# EAGLE schematic board-auto-wover (EAGLE 9.5.2)
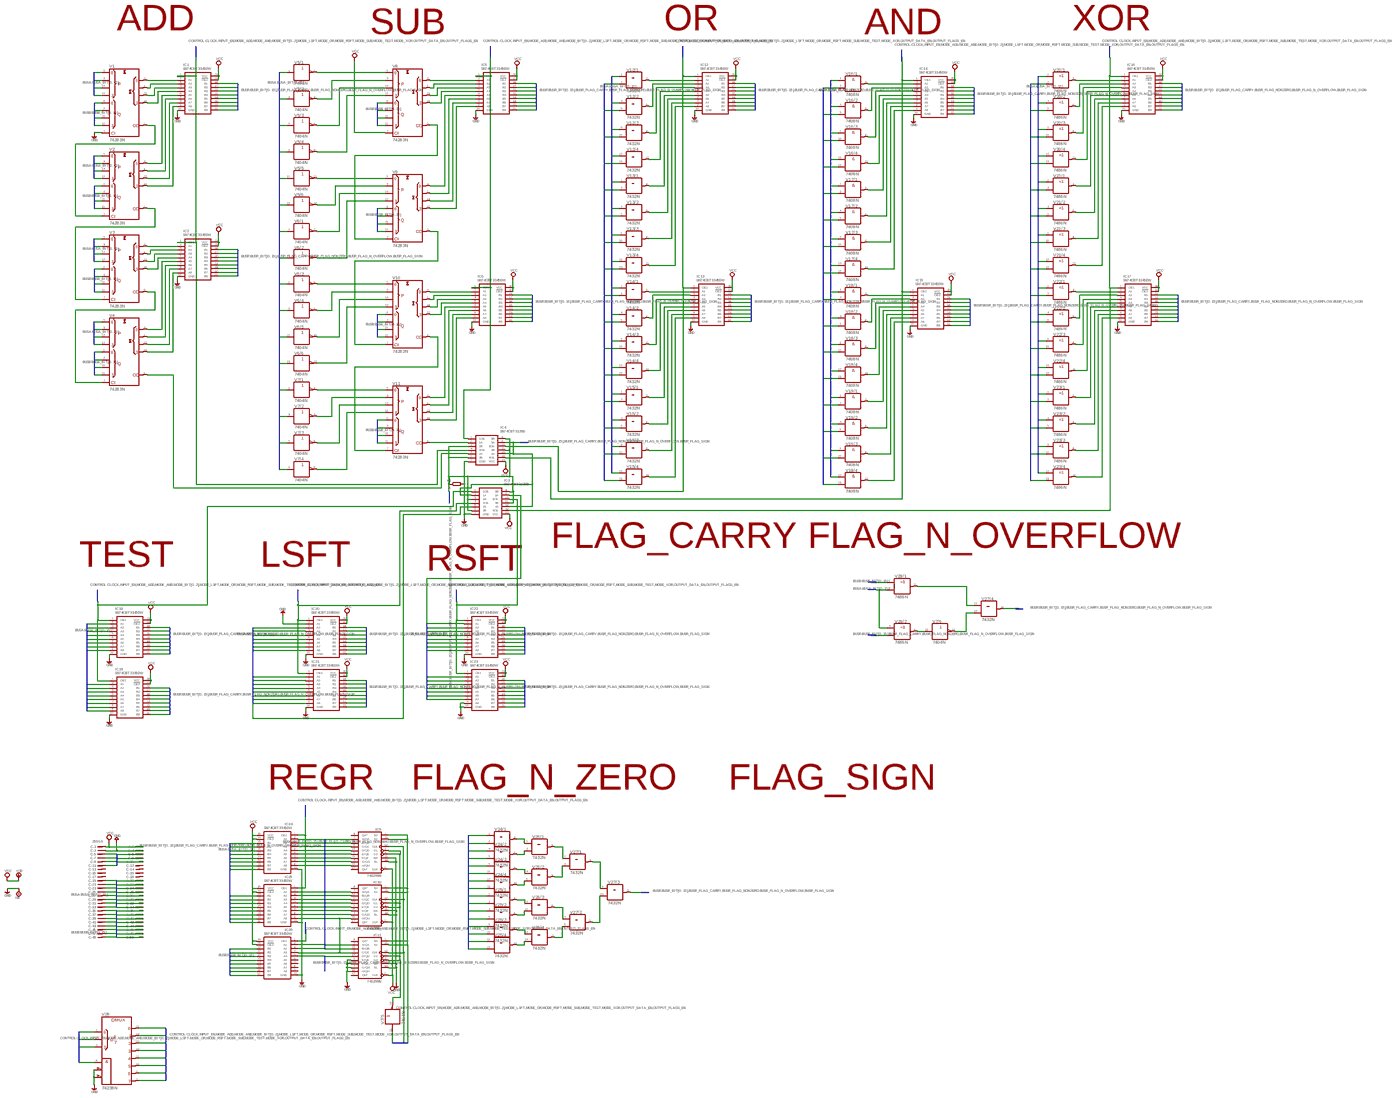
[diagram p0: schematic, sheet 1, overview]
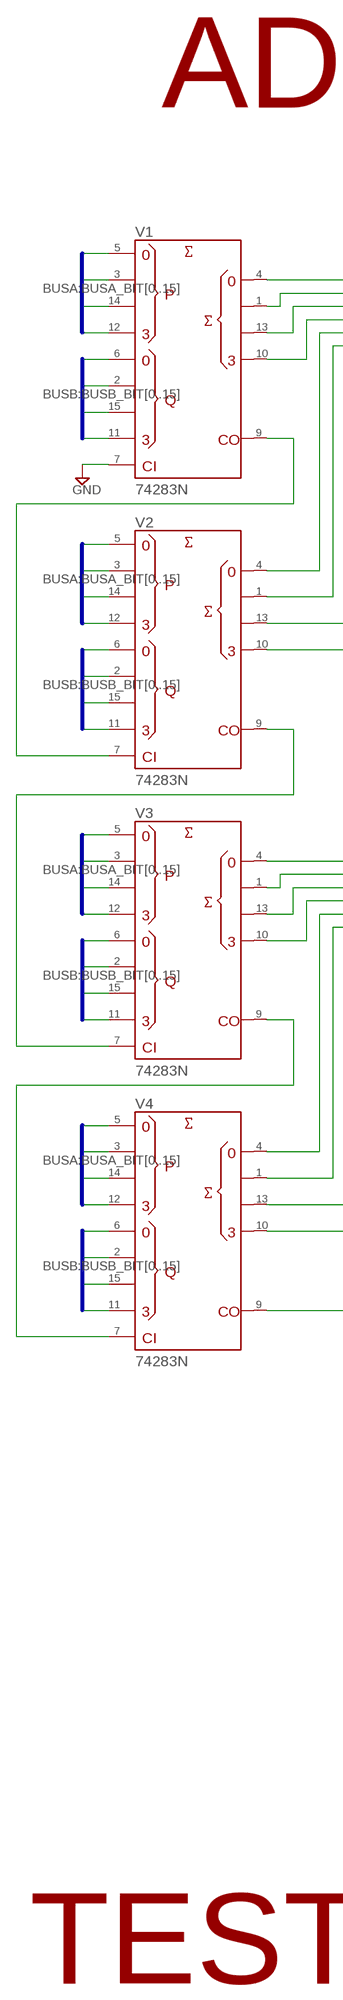
[diagram p1: schematic, sheet 1, part 1 of 6]
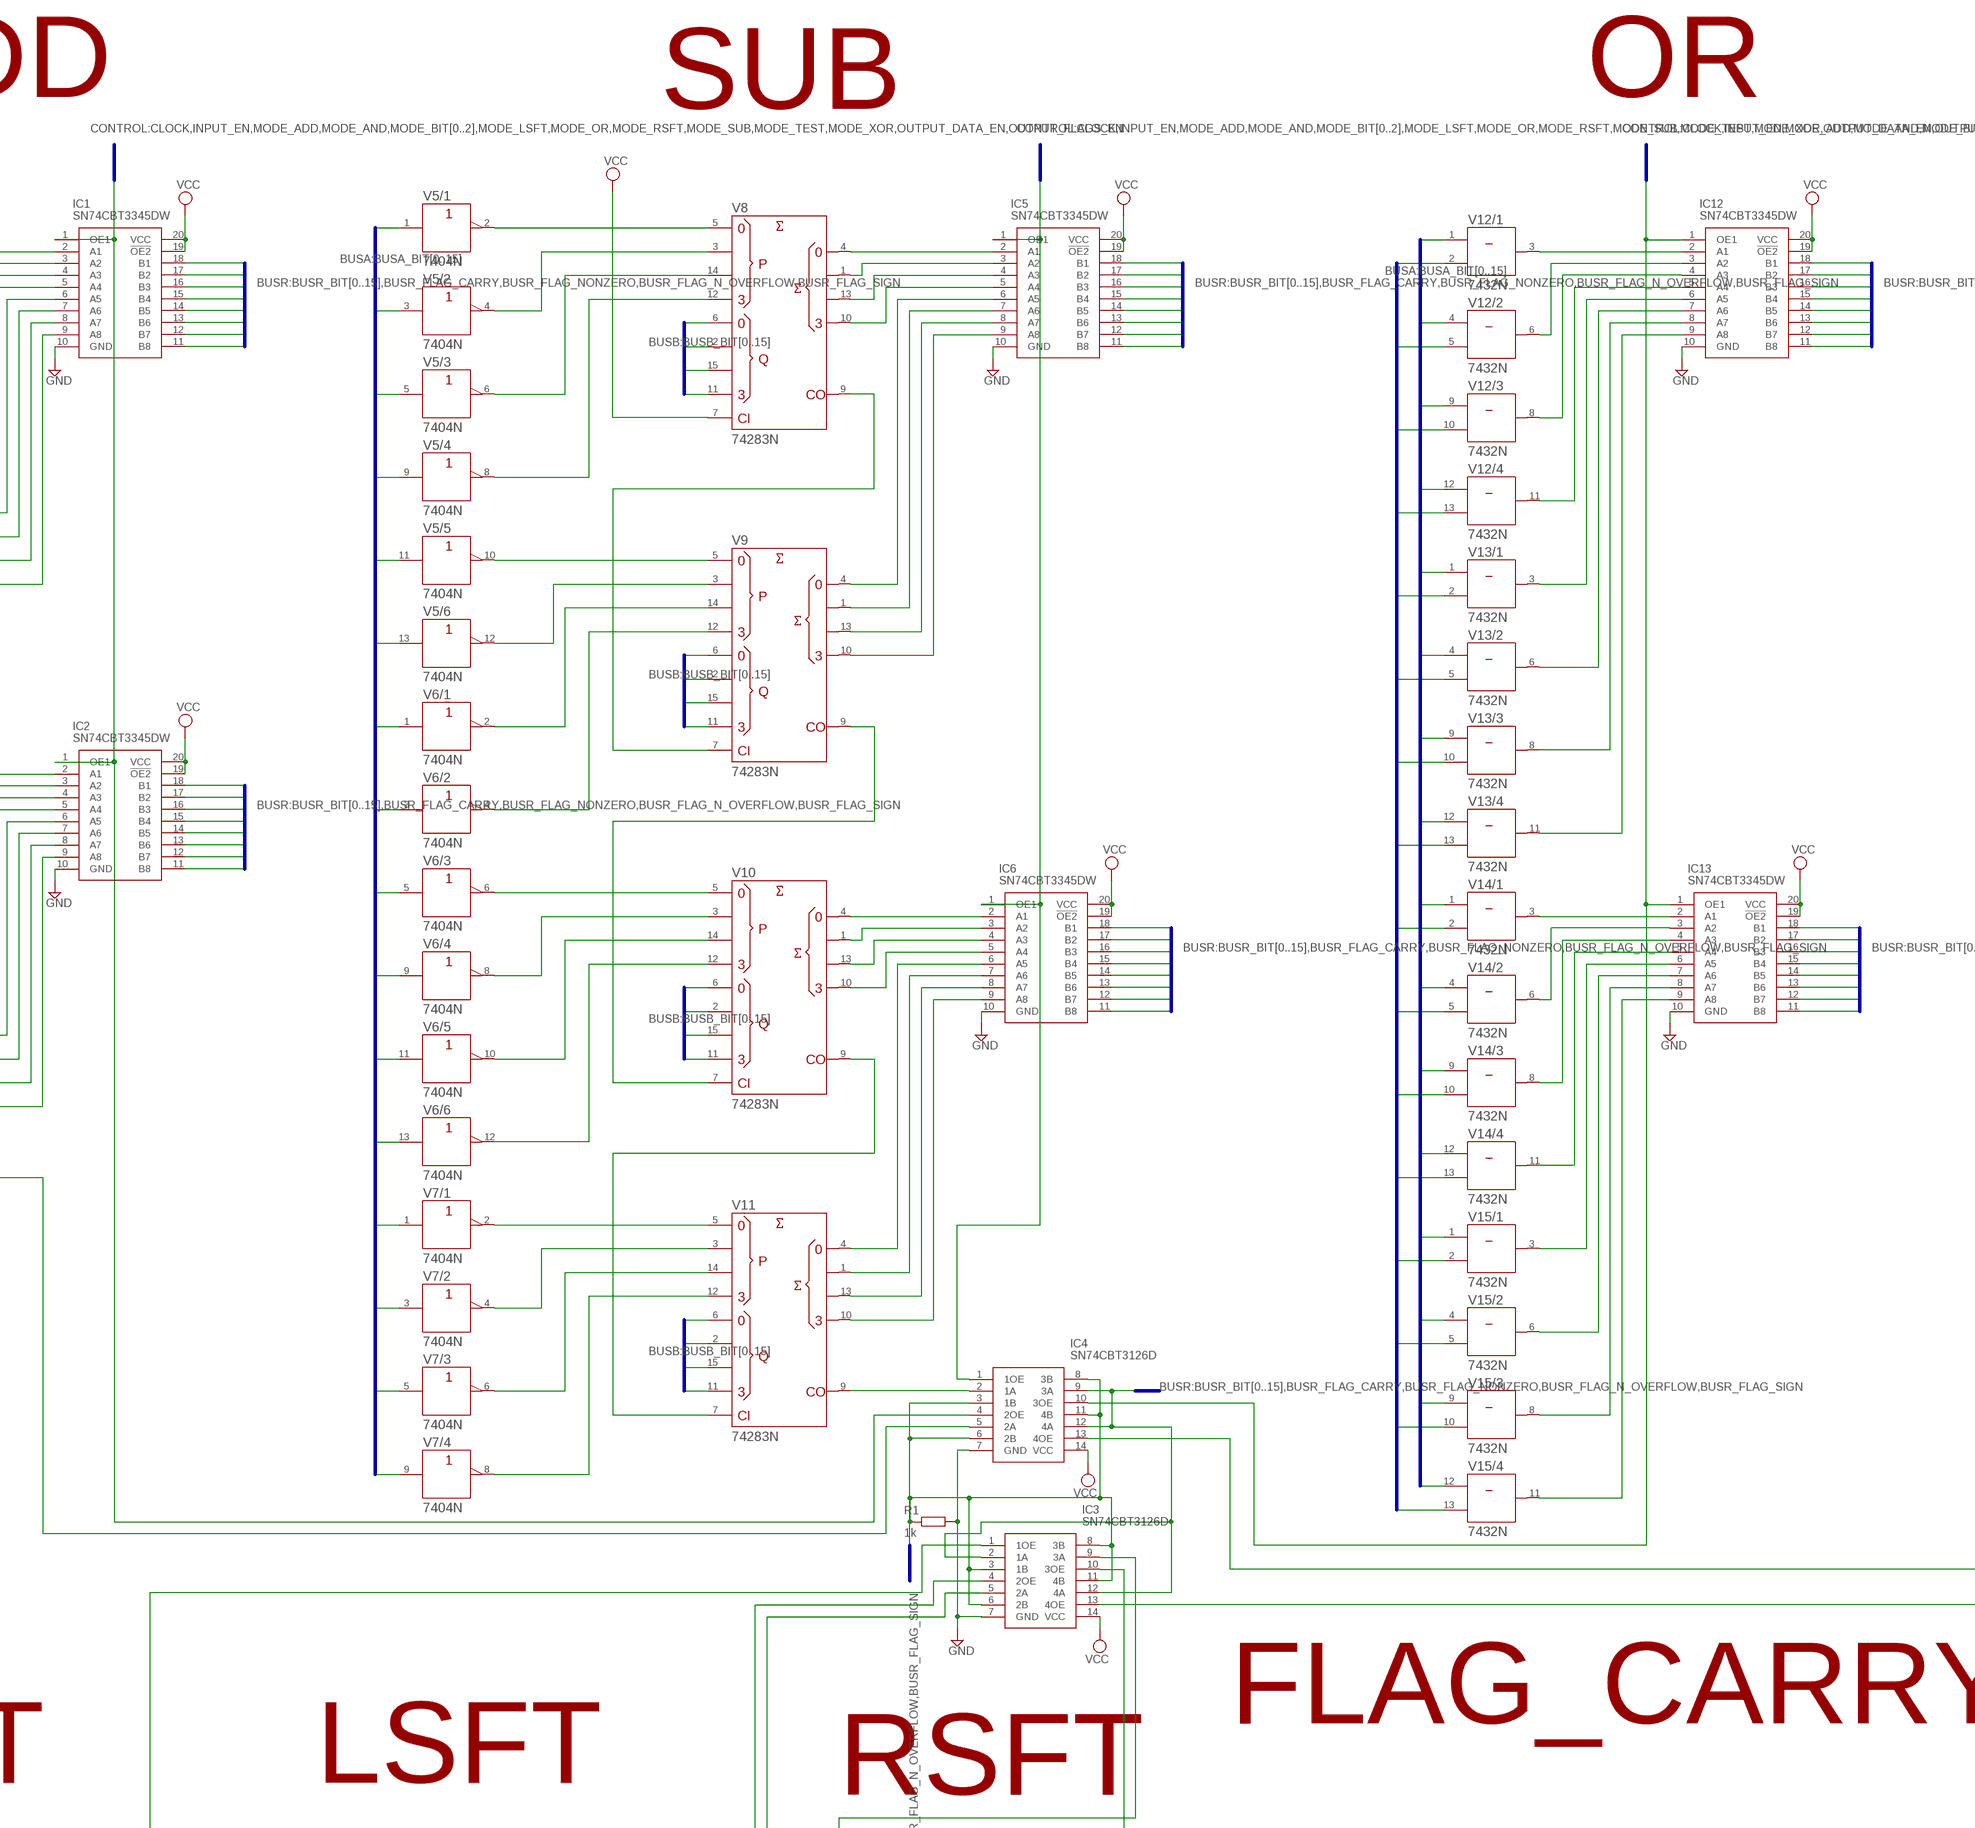
[diagram p2: schematic, sheet 1, part 2 of 6]
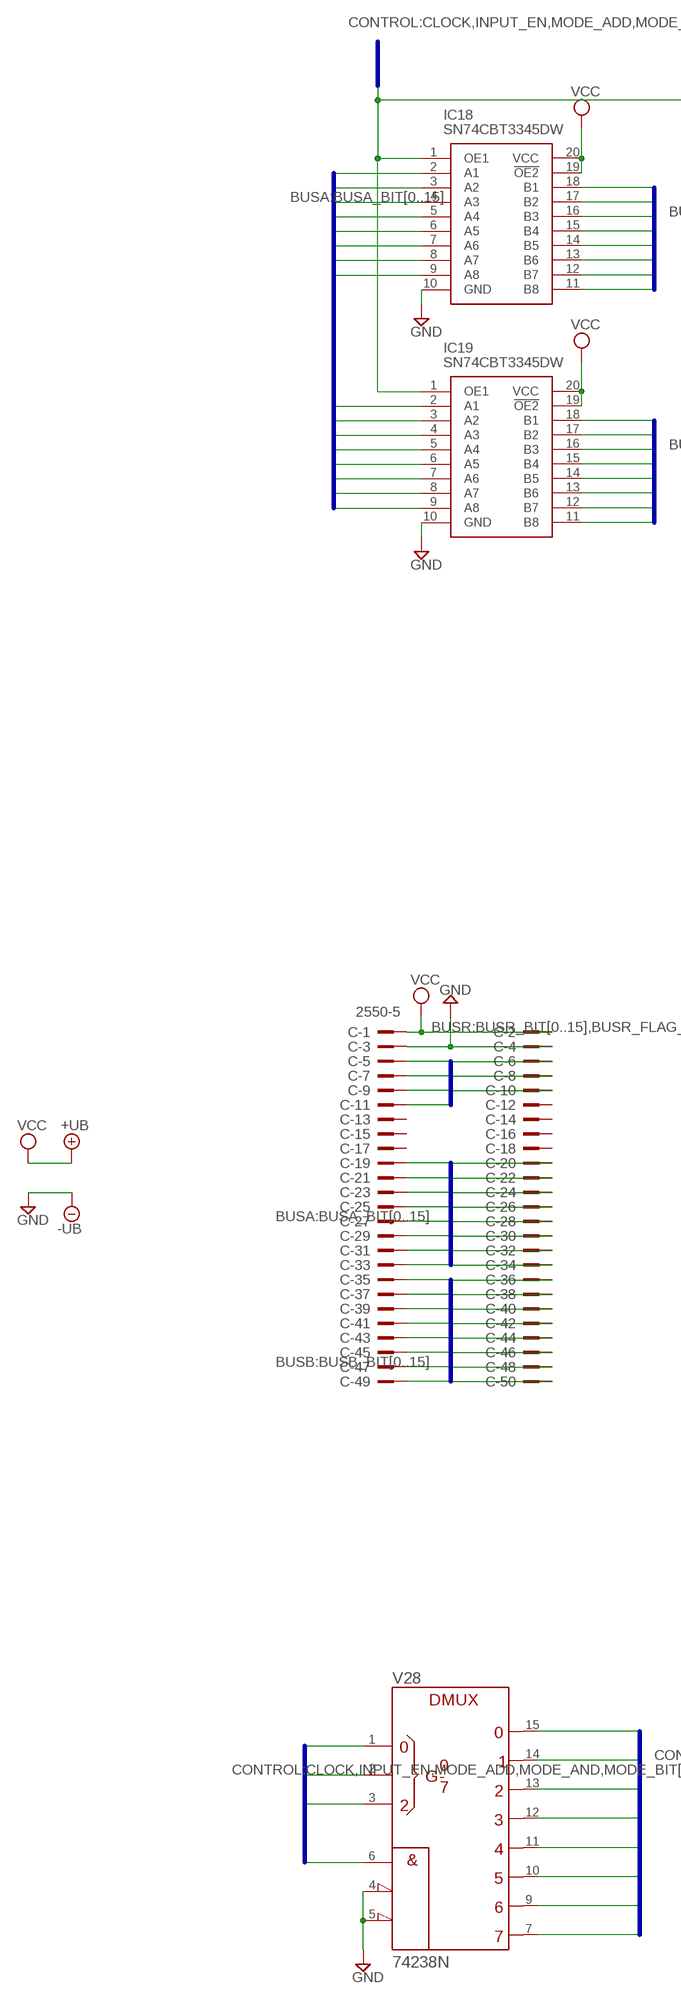
[diagram p3: schematic, sheet 1, part 3 of 6]
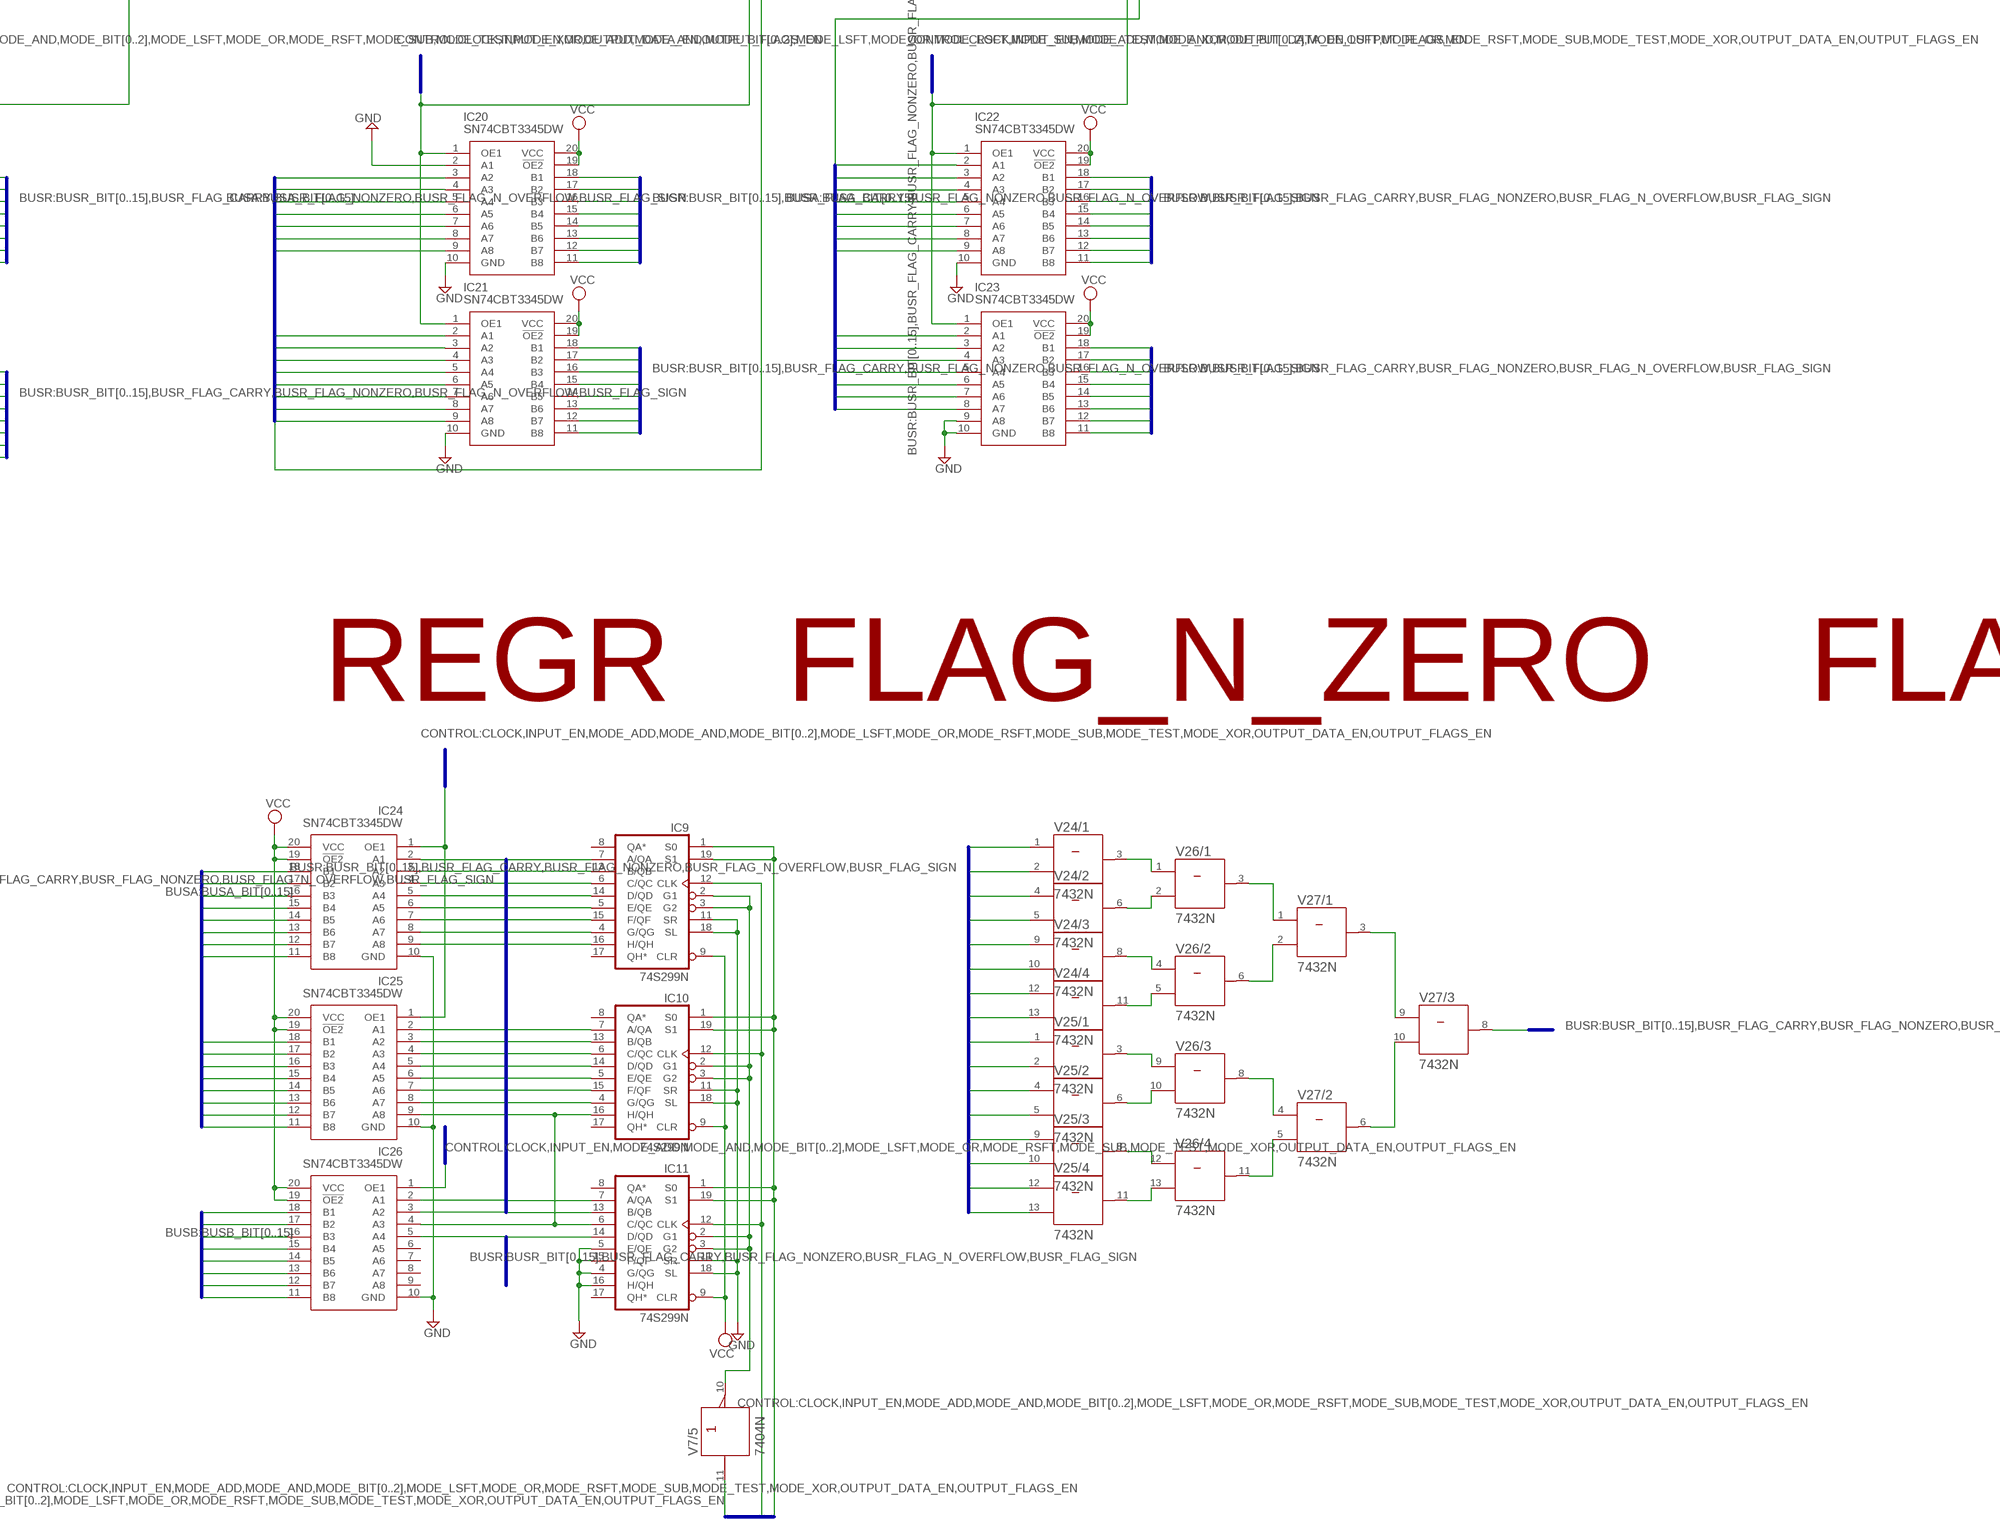
[diagram p4: schematic, sheet 1, part 4 of 6]
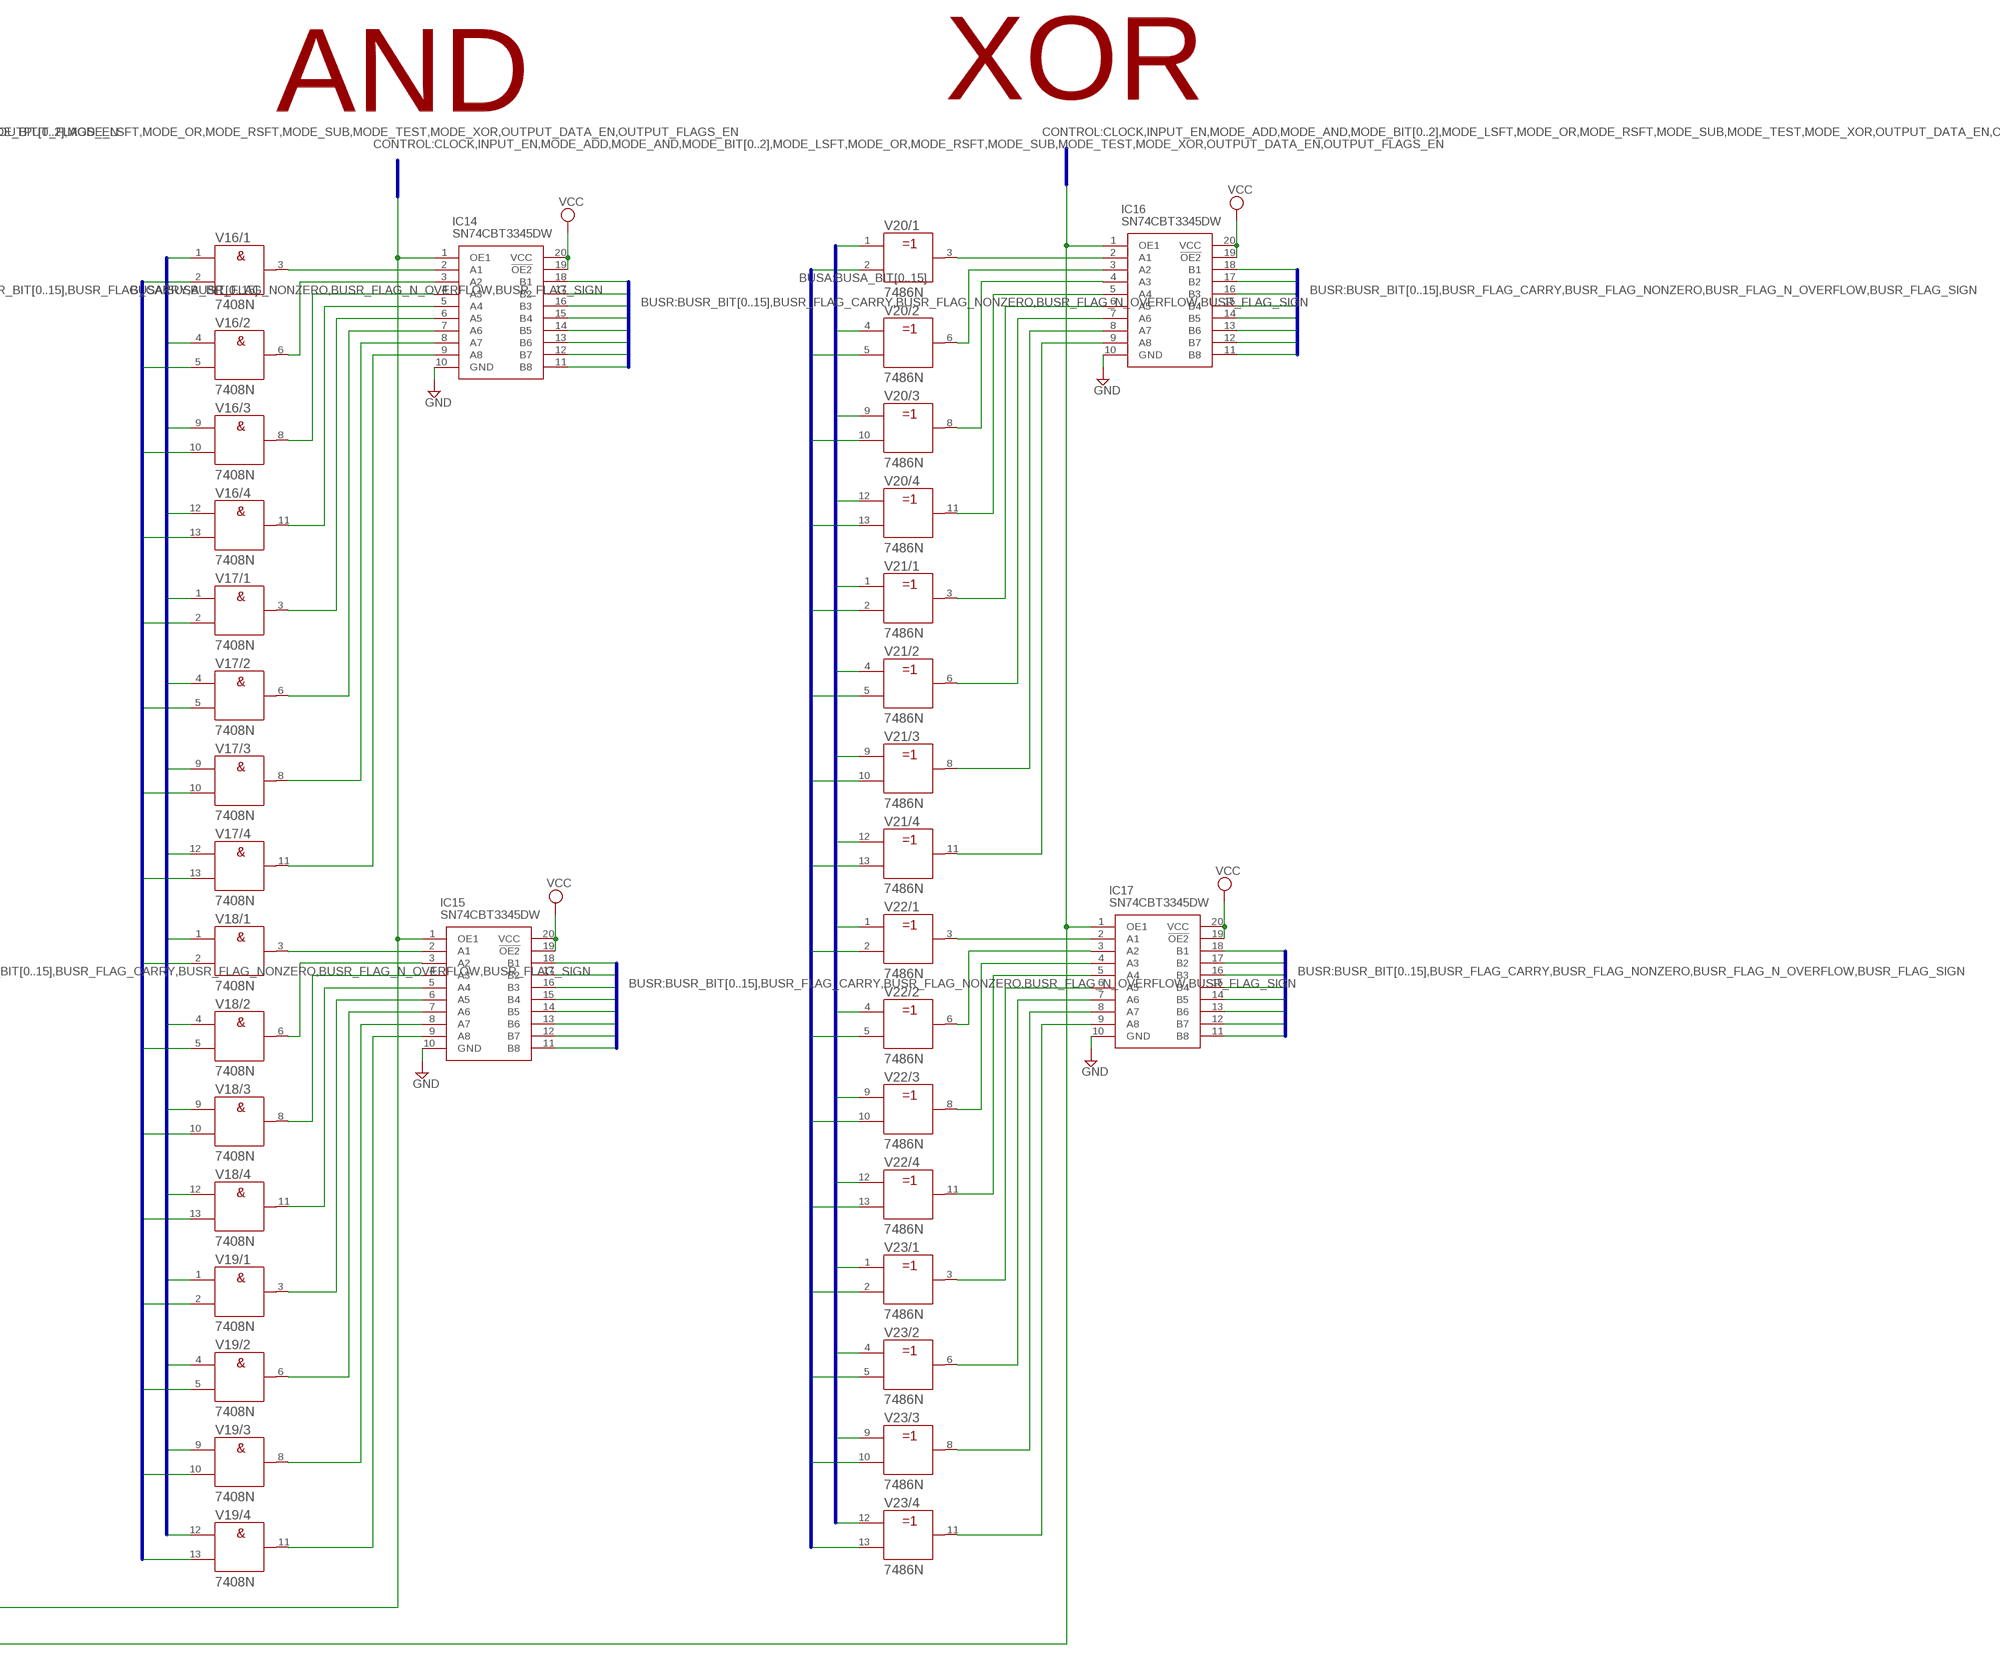
[diagram p5: schematic, sheet 1, part 5 of 6]
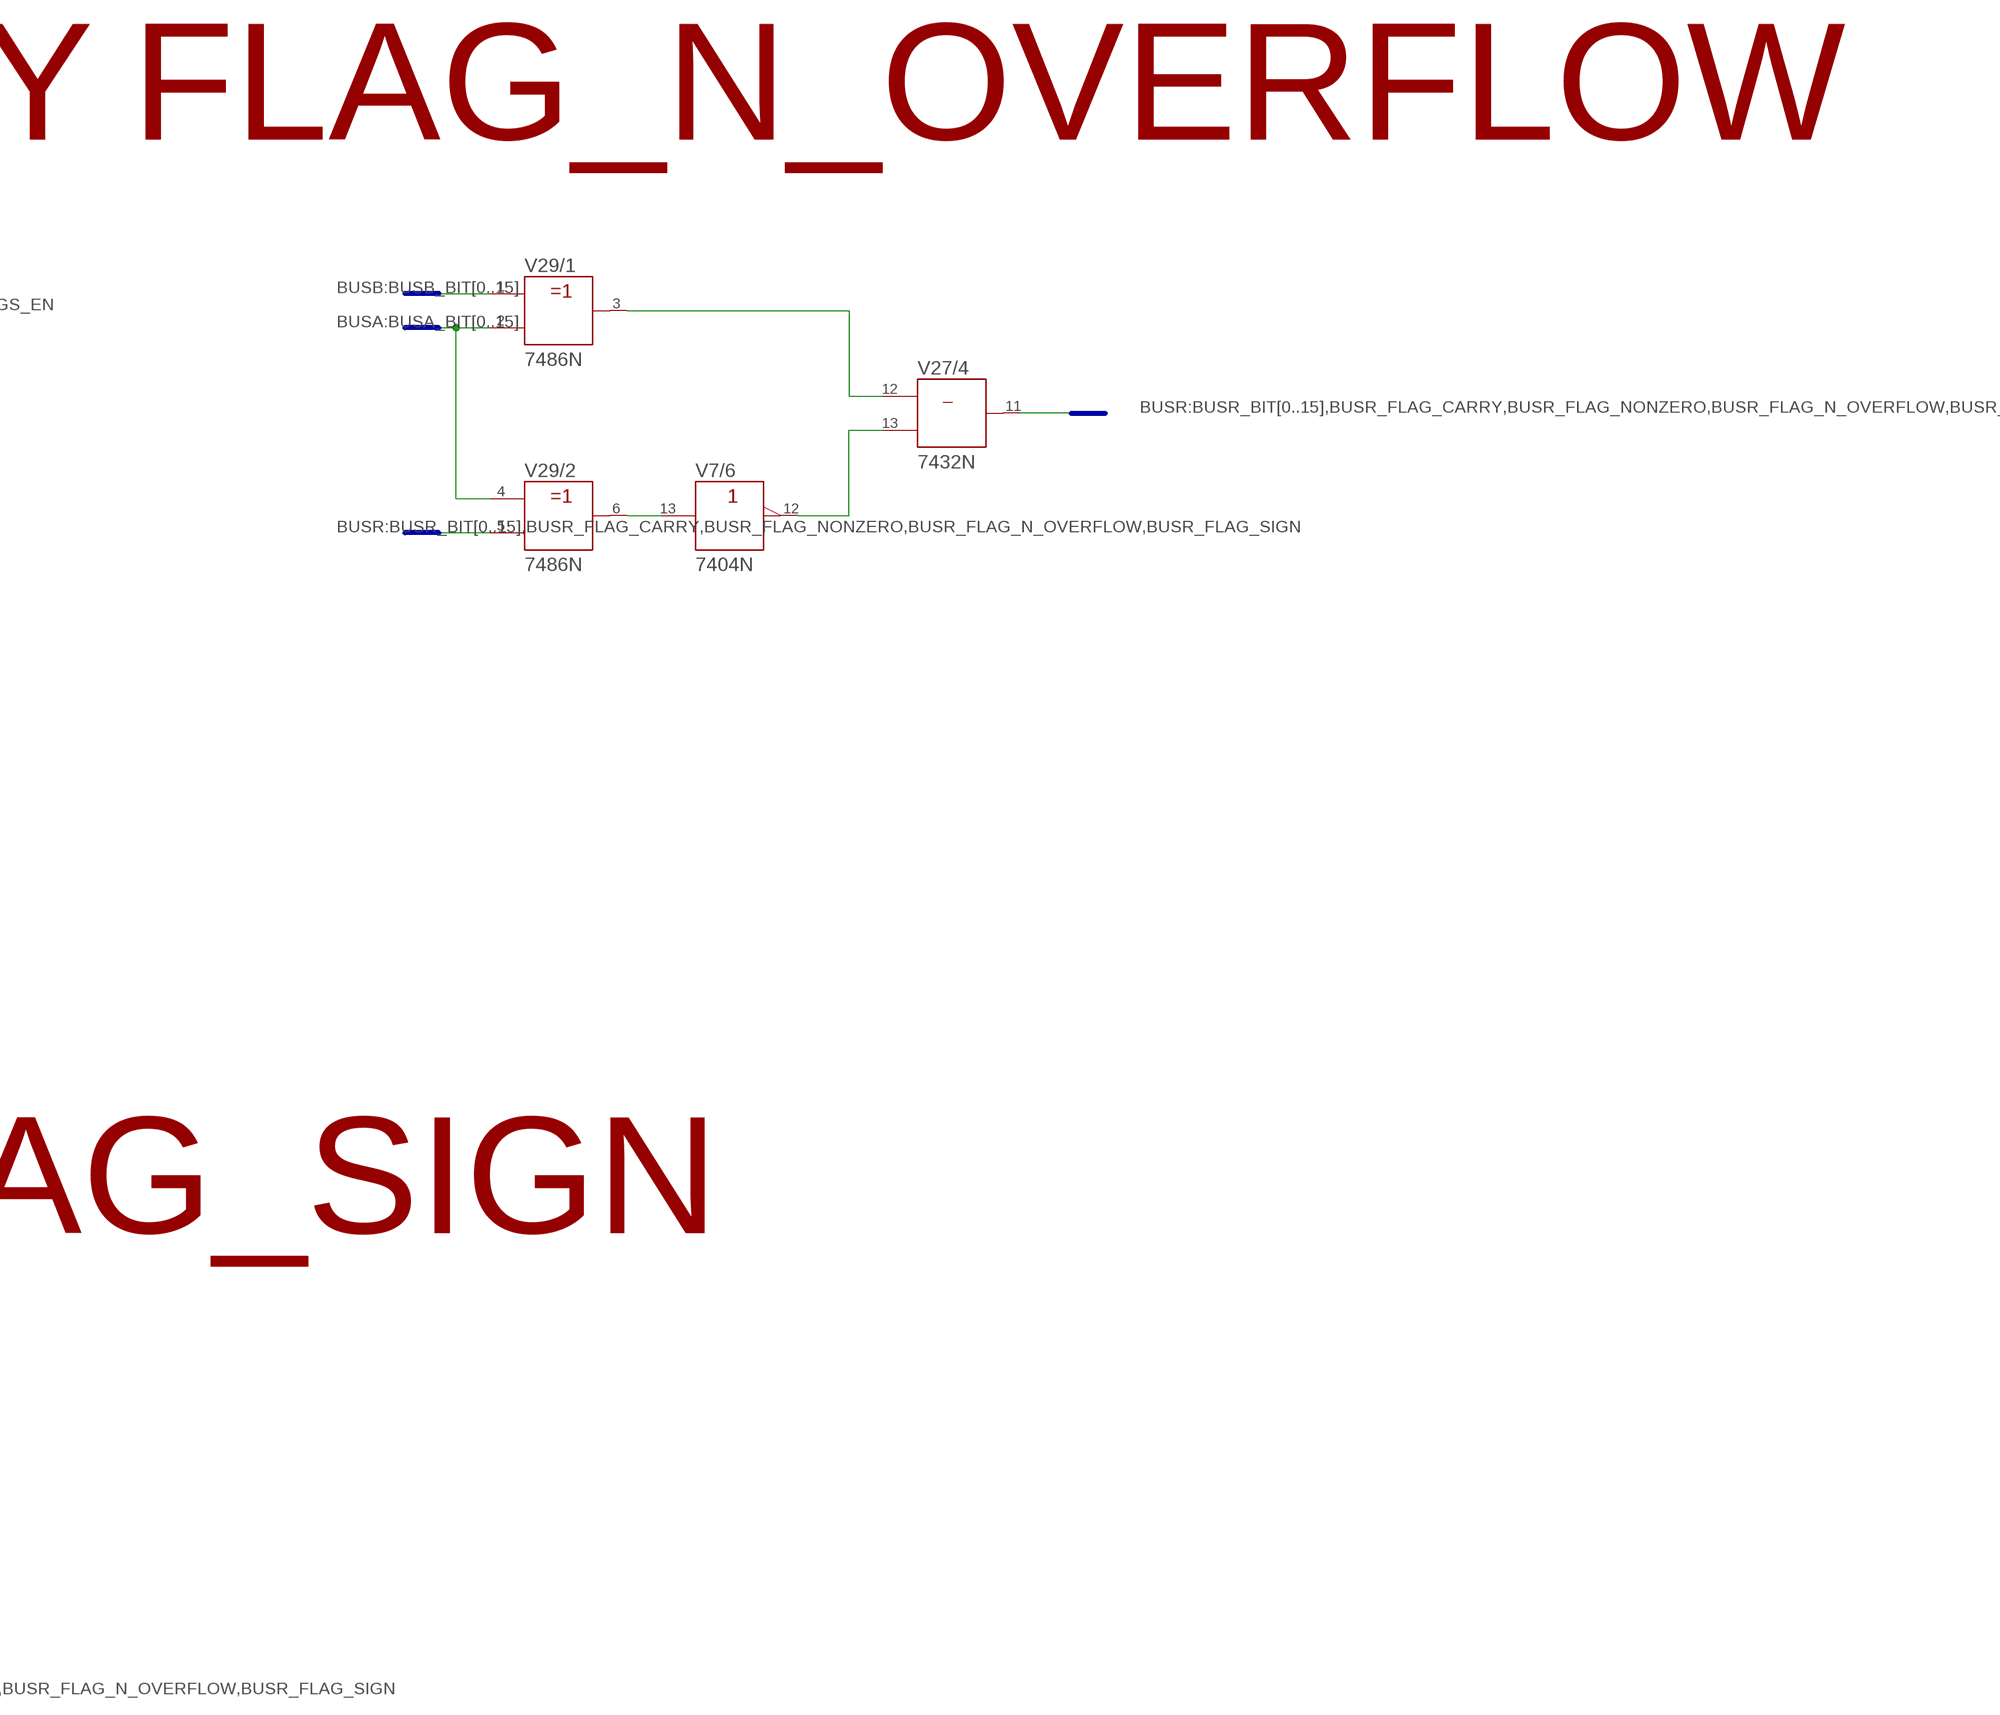
[diagram p6: schematic, sheet 1, part 6 of 6]

## Parts
C  2550-5  [PAK100/2500-5-50]
IC1  SN74CBT3345DW  [SOIC127P1030X265-20N]
IC2  SN74CBT3345DW  [SOIC127P1030X265-20N]
IC3  SN74CBT3126D  [SOIC127P600X175-14N]
IC4  SN74CBT3126D  [SOIC127P600X175-14N]
IC5  SN74CBT3345DW  [SOIC127P1030X265-20N]
IC6  SN74CBT3345DW  [SOIC127P1030X265-20N]
IC9  74S299N  [DIL20]
IC10  74S299N  [DIL20]
IC11  74S299N  [DIL20]
IC12  SN74CBT3345DW  [SOIC127P1030X265-20N]
IC13  SN74CBT3345DW  [SOIC127P1030X265-20N]
IC14  SN74CBT3345DW  [SOIC127P1030X265-20N]
IC15  SN74CBT3345DW  [SOIC127P1030X265-20N]
IC16  SN74CBT3345DW  [SOIC127P1030X265-20N]
IC17  SN74CBT3345DW  [SOIC127P1030X265-20N]
IC18  SN74CBT3345DW  [SOIC127P1030X265-20N]
IC19  SN74CBT3345DW  [SOIC127P1030X265-20N]
IC20  SN74CBT3345DW  [SOIC127P1030X265-20N]
IC21  SN74CBT3345DW  [SOIC127P1030X265-20N]
IC22  SN74CBT3345DW  [SOIC127P1030X265-20N]
IC23  SN74CBT3345DW  [SOIC127P1030X265-20N]
IC24  SN74CBT3345DW  [SOIC127P1030X265-20N]
IC25  SN74CBT3345DW  [SOIC127P1030X265-20N]
IC26  SN74CBT3345DW  [SOIC127P1030X265-20N]
R1  1k  R-EU_0207/10  [0207/10]
V1  74283N  [DIL16]
V2  74283N  [DIL16]
V3  74283N  [DIL16]
V4  74283N  [DIL16]
V5  7404N  [DIL14]
V6  7404N  [DIL14]
V7  7404N  [DIL14]
V8  74283N  [DIL16]
V9  74283N  [DIL16]
V10  74283N  [DIL16]
V11  74283N  [DIL16]
V12  7432N  [DIL14]
V13  7432N  [DIL14]
V14  7432N  [DIL14]
V15  7432N  [DIL14]
V16  7408N  [DIL14]
V17  7408N  [DIL14]
V18  7408N  [DIL14]
V19  7408N  [DIL14]
V20  7486N  [DIL14]
V21  7486N  [DIL14]
V22  7486N  [DIL14]
V23  7486N  [DIL14]
V24  7432N  [DIL14]
V25  7432N  [DIL14]
V26  7432N  [DIL14]
V27  7432N  [DIL14]
V28  74238N  [DIL16]
V29  7486N  [DIL14]

## Nets
BUSA_BIT0: C.19 IC3.9(3A) IC18.2(A1) IC20.3(A2) IC24.18(B1) V1.5(A1) V5.1(/1:A) V12.1(/1:A) V16.1(/1:A) V20.1(/1:A)
BUSA_BIT1: C.20 IC18.3(A2) IC20.4(A3) IC22.2(A1) IC24.17(B2) V1.3(A2) V5.3(/2:A) V12.4(/2:A) V16.4(/2:A) V20.4(/2:A)
BUSA_BIT2: C.21 IC18.4(A3) IC20.5(A4) IC22.3(A2) IC24.16(B3) V1.14(A3) V5.5(/3:A) V12.9(/3:A) V16.9(/3:A) V20.9(/3:A)
BUSA_BIT3: C.22 IC18.5(A4) IC20.6(A5) IC22.4(A3) IC24.15(B4) V1.12(A4) V5.9(/4:A) V12.12(/4:A) V16.12(/4:A) V20.12(/4:A)
BUSA_BIT4: C.23 IC18.6(A5) IC20.7(A6) IC22.5(A4) IC24.14(B5) V2.5(A1) V5.11(/5:A) V13.1(/1:A) V17.1(/1:A) V21.1(/1:A)
BUSA_BIT5: C.24 IC18.7(A6) IC20.8(A7) IC22.6(A5) IC24.13(B6) V2.3(A2) V5.13(/6:A) V13.4(/2:A) V17.4(/2:A) V21.4(/2:A)
BUSA_BIT6: C.25 IC18.8(A7) IC20.9(A8) IC22.7(A6) IC24.12(B7) V2.14(A3) V6.1(/1:A) V13.9(/3:A) V17.9(/3:A) V21.9(/3:A)
BUSA_BIT7: C.26 IC18.9(A8) IC21.2(A1) IC22.8(A7) IC24.11(B8) V2.12(A4) V6.3(/2:A) V13.12(/4:A) V17.12(/4:A) V21.12(/4:A)
BUSA_BIT8: C.27 IC19.2(A1) IC21.3(A2) IC22.9(A8) IC25.18(B1) V3.5(A1) V6.5(/3:A) V14.1(/1:A) V18.1(/1:A) V22.1(/1:A)
BUSA_BIT9: C.28 IC19.3(A2) IC21.4(A3) IC23.2(A1) IC25.17(B2) V3.3(A2) V6.9(/4:A) V14.4(/2:A) V18.4(/2:A) V22.4(/2:A)
BUSA_BIT10: C.29 IC19.4(A3) IC21.5(A4) IC23.3(A2) IC25.16(B3) V3.14(A3) V6.11(/5:A) V14.9(/3:A) V18.9(/3:A) V22.9(/3:A)
BUSA_BIT11: C.30 IC19.5(A4) IC21.6(A5) IC23.4(A3) IC25.15(B4) V3.12(A4) V6.13(/6:A) V14.12(/4:A) V18.12(/4:A) V22.12(/4:A)
BUSA_BIT12: C.31 IC19.6(A5) IC21.7(A6) IC23.5(A4) IC25.14(B5) V4.5(A1) V7.1(/1:A) V15.1(/1:A) V19.1(/1:A) V23.1(/1:A)
BUSA_BIT13: C.32 IC19.7(A6) IC21.8(A7) IC23.6(A5) IC25.13(B6) V4.3(A2) V7.3(/2:A) V15.4(/2:A) V19.4(/2:A) V23.4(/2:A)
BUSA_BIT14: C.33 IC19.8(A7) IC21.9(A8) IC23.7(A6) IC25.12(B7) V4.14(A3) V7.5(/3:A) V15.9(/3:A) V19.9(/3:A) V23.9(/3:A)
BUSA_BIT15: C.34 IC3.5(2A) IC19.9(A8) IC23.8(A7) IC25.11(B8) V4.12(A4) V7.9(/4:A) V15.12(/4:A) V19.12(/4:A) V23.12(/4:A) V29.2(/1:B) V29.4(/2:A)
BUSB_BIT0: C.35 IC26.18(B1) V1.6(B1) V8.6(B1) V12.2(/1:B) V16.2(/1:B) V20.2(/1:B)
BUSB_BIT1: C.36 IC26.17(B2) V1.2(B2) V8.2(B2) V12.5(/2:B) V16.5(/2:B) V20.5(/2:B)
BUSB_BIT2: C.37 IC26.16(B3) V1.15(B3) V8.15(B3) V12.10(/3:B) V16.10(/3:B) V20.10(/3:B)
BUSB_BIT3: C.38 IC26.15(B4) V1.11(B4) V8.11(B4) V12.13(/4:B) V16.13(/4:B) V20.13(/4:B)
BUSB_BIT4: C.39 IC26.14(B5) V2.6(B1) V9.6(B1) V13.2(/1:B) V17.2(/1:B) V21.2(/1:B)
BUSB_BIT5: C.40 IC26.13(B6) V2.2(B2) V9.2(B2) V13.5(/2:B) V17.5(/2:B) V21.5(/2:B)
BUSB_BIT6: C.41 IC26.12(B7) V2.15(B3) V9.15(B3) V13.10(/3:B) V17.10(/3:B) V21.10(/3:B)
BUSB_BIT7: C.42 IC26.11(B8) V2.11(B4) V9.11(B4) V13.13(/4:B) V17.13(/4:B) V21.13(/4:B)
BUSB_BIT8: C.43 V3.6(B1) V10.6(B1) V14.2(/1:B) V18.2(/1:B) V22.2(/1:B)
BUSB_BIT9: C.44 V3.2(B2) V10.2(B2) V14.5(/2:B) V18.5(/2:B) V22.5(/2:B)
BUSB_BIT10: C.45 V3.15(B3) V10.15(B3) V14.10(/3:B) V18.10(/3:B) V22.10(/3:B)
BUSB_BIT11: C.46 V3.11(B4) V10.11(B4) V14.13(/4:B) V18.13(/4:B) V22.13(/4:B)
BUSB_BIT12: C.47 V4.6(B1) V11.6(B1) V15.2(/1:B) V19.2(/1:B) V23.2(/1:B)
BUSB_BIT13: C.48 V4.2(B2) V11.2(B2) V15.5(/2:B) V19.5(/2:B) V23.5(/2:B)
BUSB_BIT14: C.49 V4.15(B3) V11.15(B3) V15.10(/3:B) V19.10(/3:B) V23.10(/3:B)
BUSB_BIT15: C.50 V4.11(B4) V11.11(B4) V15.13(/4:B) V19.13(/4:B) V23.13(/4:B) V29.1(/1:A)
BUSR_BIT0: IC1.18(B1) IC3.2(1A) IC3.12(4A) IC4.9(3A) IC4.12(4A) IC5.18(B1) IC9.7(A/QA) IC12.18(B1) IC14.18(B1) IC16.18(B1) IC18.18(B1) IC20.18(B1) IC22.18(B1) IC24.2(A1) V24.1(/1:A)
BUSR_BIT1: IC1.17(B2) IC5.17(B2) IC9.13(B/QB) IC12.17(B2) IC14.17(B2) IC16.17(B2) IC18.17(B2) IC20.17(B2) IC22.17(B2) IC24.3(A2) V24.2(/1:B)
BUSR_BIT2: IC1.16(B3) IC5.16(B3) IC9.6(C/QC) IC12.16(B3) IC14.16(B3) IC16.16(B3) IC18.16(B3) IC20.16(B3) IC22.16(B3) IC24.4(A3) V24.4(/2:A)
BUSR_BIT3: IC1.15(B4) IC5.15(B4) IC9.14(D/QD) IC12.15(B4) IC14.15(B4) IC16.15(B4) IC18.15(B4) IC20.15(B4) IC22.15(B4) IC24.5(A4) V24.5(/2:B)
BUSR_BIT4: IC1.14(B5) IC5.14(B5) IC9.5(E/QE) IC12.14(B5) IC14.14(B5) IC16.14(B5) IC18.14(B5) IC20.14(B5) IC22.14(B5) IC24.6(A5) V24.9(/3:A)
BUSR_BIT5: IC1.13(B6) IC5.13(B6) IC9.15(F/QF) IC12.13(B6) IC14.13(B6) IC16.13(B6) IC18.13(B6) IC20.13(B6) IC22.13(B6) IC24.7(A6) V24.10(/3:B)
BUSR_BIT6: IC1.12(B7) IC5.12(B7) IC9.4(G/QG) IC12.12(B7) IC14.12(B7) IC16.12(B7) IC18.12(B7) IC20.12(B7) IC22.12(B7) IC24.8(A7) V24.12(/4:A)
BUSR_BIT7: IC1.11(B8) IC5.11(B8) IC9.16(H/QH) IC12.11(B8) IC14.11(B8) IC16.11(B8) IC18.11(B8) IC20.11(B8) IC22.11(B8) IC24.9(A8) V24.13(/4:B)
BUSR_BIT8: IC2.18(B1) IC6.18(B1) IC10.7(A/QA) IC13.18(B1) IC15.18(B1) IC17.18(B1) IC19.18(B1) IC21.18(B1) IC23.18(B1) IC25.2(A1) V25.1(/1:A)
BUSR_BIT9: IC2.17(B2) IC6.17(B2) IC10.13(B/QB) IC13.17(B2) IC15.17(B2) IC17.17(B2) IC19.17(B2) IC21.17(B2) IC23.17(B2) IC25.3(A2) V25.2(/1:B)
BUSR_BIT10: IC2.16(B3) IC6.16(B3) IC10.6(C/QC) IC13.16(B3) IC15.16(B3) IC17.16(B3) IC19.16(B3) IC21.16(B3) IC23.16(B3) IC25.4(A3) V25.4(/2:A)
BUSR_BIT11: IC2.15(B4) IC6.15(B4) IC10.14(D/QD) IC13.15(B4) IC15.15(B4) IC17.15(B4) IC19.15(B4) IC21.15(B4) IC23.15(B4) IC25.5(A4) V25.5(/2:B)
BUSR_BIT12: IC2.14(B5) IC6.14(B5) IC10.5(E/QE) IC13.14(B5) IC15.14(B5) IC17.14(B5) IC19.14(B5) IC21.14(B5) IC23.14(B5) IC25.6(A5) V25.9(/3:A)
BUSR_BIT13: IC2.13(B6) IC6.13(B6) IC10.15(F/QF) IC13.13(B6) IC15.13(B6) IC17.13(B6) IC19.13(B6) IC21.13(B6) IC23.13(B6) IC25.7(A6) V25.10(/3:B)
BUSR_BIT14: IC2.12(B7) IC6.12(B7) IC10.4(G/QG) IC13.12(B7) IC15.12(B7) IC17.12(B7) IC19.12(B7) IC21.12(B7) IC23.12(B7) IC25.8(A7) V25.12(/4:A)
BUSR_BIT15: IC2.11(B8) IC6.11(B8) IC10.16(H/QH) IC11.6(C/QC) IC13.11(B8) IC15.11(B8) IC17.11(B8) IC19.11(B8) IC21.11(B8) IC23.11(B8) IC25.9(A8) IC26.4(A3) V25.13(/4:B) V29.5(/2:B)
BUSR_FLAG_CARRY: IC3.3(1B) IC3.6(2B) IC3.8(3B) IC3.11(4B) IC4.3(1B) IC4.6(2B) IC4.8(3B) IC4.11(4B) IC11.7(A/QA) IC26.2(A1) R1.1
BUSR_FLAG_N_OVERFLOW: IC11.14(D/QD) IC26.5(A4) V27.11(/4:Y)
BUSR_FLAG_NONZERO: IC11.13(B/QB) IC26.3(A2) V27.8(/3:Y)
CLOCK: C.5 IC9.12(CLK) IC10.12(CLK) IC11.12(CLK)
GND: C.3 C.4 IC1.10(GND) IC2.10(GND) IC3.7(GND) IC4.7(GND) IC5.10(GND) IC6.10(GND) IC9.11(SR) IC9.18(SL) IC10.11(SR) IC10.18(SL) IC11.4(G/QG) IC11.5(E/QE) IC11.11(SR) IC11.15(F/QF) IC11.16(H/QH) IC11.18(SL) IC12.10(GND) IC13.10(GND) IC14.10(GND) IC15.10(GND) IC16.10(GND) IC17.10(GND) IC18.10(GND) IC19.10(GND) IC20.2(A1) IC20.10(GND) IC21.10(GND) IC22.10(GND) IC23.9(A8) IC23.10(GND) IC24.10(GND) IC25.10(GND) IC26.10(GND) R1.2 V1.7(C0) V28.4(!G2A) V28.5(!G2B) ; supply symbol labelled -UB
INPUT_EN: C.7 IC9.1(S0) IC9.19(S1) IC10.1(S0) IC10.19(S1) IC11.1(S0) IC11.19(S1) V28.6(G1)
MODE_ADD: IC1.1(OE1) IC2.1(OE1) IC4.4(2OE) V28.15(Y0)
MODE_AND: IC4.13(4OE) IC14.1(OE1) IC15.1(OE1) V28.13(Y2)
MODE_BIT0: C.6 V28.1(A)
MODE_BIT1: C.8 V28.2(B)
MODE_BIT2: C.10 V28.3(C)
MODE_LSFT: IC3.4(2OE) IC20.1(OE1) IC21.1(OE1) V28.10(Y5)
MODE_OR: IC4.10(3OE) IC12.1(OE1) IC13.1(OE1) V28.12(Y3)
MODE_RSFT: IC3.10(3OE) IC22.1(OE1) IC23.1(OE1) V28.9(Y6)
MODE_SUB: IC4.1(1OE) IC5.1(OE1) IC6.1(OE1) V28.14(Y1)
MODE_TEST: IC3.1(1OE) IC18.1(OE1) IC19.1(OE1) V28.7(Y7)
MODE_XOR: IC3.13(4OE) IC16.1(OE1) IC17.1(OE1) V28.11(Y4)
N$1: V1.9(C4) V2.7(C0)
N$2: V2.9(C4) V3.7(C0)
N$3: V3.9(C4) V4.7(C0)
N$4: V8.9(C4) V9.7(C0)
N$5: V9.9(C4) V10.7(C0)
N$6: V10.9(C4) V11.7(C0)
N$7: V5.2(/1:Y) V8.5(A1)
N$8: V5.4(/2:Y) V8.3(A2)
N$9: V5.6(/3:Y) V8.14(A3)
N$10: V5.8(/4:Y) V8.12(A4)
N$11: V5.10(/5:Y) V9.5(A1)
N$12: V5.12(/6:Y) V9.3(A2)
N$13: V6.2(/1:Y) V9.14(A3)
N$14: V6.4(/2:Y) V9.12(A4)
N$15: V6.6(/3:Y) V10.5(A1)
N$16: V6.8(/4:Y) V10.3(A2)
N$17: V6.10(/5:Y) V10.14(A3)
N$18: V6.12(/6:Y) V10.12(A4)
N$19: V7.2(/1:Y) V11.5(A1)
N$20: V7.4(/2:Y) V11.3(A2)
N$21: V7.6(/3:Y) V11.14(A3)
N$22: V7.8(/4:Y) V11.12(A4)
N$23: IC1.2(A1) V1.4(S1)
N$24: IC1.3(A2) V1.1(S2)
N$25: IC1.4(A3) V1.13(S3)
N$26: IC1.5(A4) V1.10(S4)
N$27: IC1.6(A5) V2.4(S1)
N$28: IC1.7(A6) V2.1(S2)
N$29: IC1.8(A7) V2.13(S3)
N$30: IC1.9(A8) V2.10(S4)
N$31: IC2.2(A1) V3.4(S1)
N$32: IC2.3(A2) V3.1(S2)
N$33: IC2.4(A3) V3.13(S3)
N$34: IC2.5(A4) V3.10(S4)
N$35: IC2.6(A5) V4.4(S1)
N$36: IC2.7(A6) V4.1(S2)
N$37: IC2.8(A7) V4.13(S3)
N$38: IC2.9(A8) V4.10(S4)
N$39: IC5.2(A1) V8.4(S1)
N$40: IC5.3(A2) V8.1(S2)
N$41: IC5.4(A3) V8.13(S3)
N$42: IC5.5(A4) V8.10(S4)
N$43: IC5.6(A5) V9.4(S1)
N$44: IC5.7(A6) V9.1(S2)
N$45: IC5.8(A7) V9.13(S3)
N$46: IC5.9(A8) V9.10(S4)
N$47: IC6.2(A1) V10.4(S1)
N$48: IC6.3(A2) V10.1(S2)
N$49: IC4.5(2A) V4.9(C4)
N$50: IC6.5(A4) V10.10(S4)
N$51: IC6.6(A5) V11.4(S1)
N$52: IC6.7(A6) V11.1(S2)
N$53: IC6.8(A7) V11.13(S3)
N$54: IC6.9(A8) V11.10(S4)
N$55: IC13.8(A7) V15.8(/3:Y)
N$56: IC6.4(A3) V10.13(S3)
N$57: IC4.2(1A) V11.9(C4)
N$58: IC14.2(A1) V16.3(/1:Y)
N$59: V27.12(/4:A) V29.3(/1:Y)
N$61: V7.12(/6:Y) V27.13(/4:B)
N$62: V7.13(/6:A) V29.6(/2:Y)
N$66: V24.3(/1:Y) V26.1(/1:A)
N$67: IC14.3(A2) V16.6(/2:Y)
N$68: IC12.2(A1) V12.3(/1:Y)
N$70: IC9.2(G1) IC9.3(G2) IC10.2(G1) IC10.3(G2) IC11.2(G1) IC11.3(G2) V7.10(/5:Y)
N$72: IC12.3(A2) V12.6(/2:Y)
N$74: IC14.5(A4) V16.11(/4:Y)
N$75: IC12.5(A4) V12.11(/4:Y)
N$77: IC12.6(A5) V13.3(/1:Y)
N$78: IC12.7(A6) V13.6(/2:Y)
N$79: IC14.6(A5) V17.3(/1:Y)
N$80: IC12.9(A8) V13.11(/4:Y)
N$81: IC13.2(A1) V14.3(/1:Y)
N$82: IC14.7(A6) V17.6(/2:Y)
N$83: IC13.4(A3) V14.8(/3:Y)
N$84: IC13.5(A4) V14.11(/4:Y)
N$85: IC13.6(A5) V15.3(/1:Y)
N$86: IC14.9(A8) V17.11(/4:Y)
N$87: IC15.2(A1) V18.3(/1:Y)
N$88: IC15.4(A3) V18.8(/3:Y)
N$89: IC15.5(A4) V18.11(/4:Y)
N$90: IC15.6(A5) V19.3(/1:Y)
N$91: IC12.4(A3) V12.8(/3:Y)
N$92: IC14.4(A3) V16.8(/3:Y)
N$93: IC14.8(A7) V17.8(/3:Y)
N$94: IC15.3(A2) V18.6(/2:Y)
N$95: IC12.8(A7) V13.8(/3:Y)
N$96: IC15.7(A6) V19.6(/2:Y)
N$97: IC15.9(A8) V19.11(/4:Y)
N$98: IC13.3(A2) V14.6(/2:Y)
N$99: IC15.8(A7) V19.8(/3:Y)
N$100: IC16.2(A1) V20.3(/1:Y)
N$101: IC13.7(A6) V15.6(/2:Y)
N$102: IC16.3(A2) V20.6(/2:Y)
N$103: IC13.9(A8) V15.11(/4:Y)
N$104: IC16.5(A4) V20.11(/4:Y)
N$105: IC16.6(A5) V21.3(/1:Y)
N$106: IC16.7(A6) V21.6(/2:Y)
N$107: IC16.9(A8) V21.11(/4:Y)
N$108: IC17.2(A1) V22.3(/1:Y)
N$109: IC17.4(A3) V22.8(/3:Y)
N$110: IC17.5(A4) V22.11(/4:Y)
N$111: IC17.6(A5) V23.3(/1:Y)
N$112: IC16.4(A3) V20.8(/3:Y)
N$113: IC16.8(A7) V21.8(/3:Y)
N$114: IC17.3(A2) V22.6(/2:Y)
N$115: IC17.7(A6) V23.6(/2:Y)
N$116: IC17.9(A8) V23.11(/4:Y)
N$117: IC17.8(A7) V23.8(/3:Y)
N$118: V24.6(/2:Y) V26.2(/1:B)
N$119: V24.11(/4:Y) V26.5(/2:B)
N$120: V25.6(/2:Y) V26.10(/3:B)
N$121: V25.11(/4:Y) V26.13(/4:B)
N$122: V26.11(/4:Y) V27.5(/2:B)
N$123: V26.6(/2:Y) V27.2(/1:B)
N$124: V26.3(/1:Y) V27.1(/1:A)
N$125: V26.8(/3:Y) V27.4(/2:A)
N$126: V27.6(/2:Y) V27.10(/3:B)
N$127: V27.3(/1:Y) V27.9(/3:A)
N$128: V25.3(/1:Y) V26.9(/3:A)
N$129: V24.8(/3:Y) V26.4(/2:A)
N$130: V25.8(/3:Y) V26.12(/4:A)
OUTPUT_DATA_EN: C.9 IC24.1(OE1) IC25.1(OE1) V7.11(/5:A)
OUTPUT_FLAGS_EN: C.11 IC26.1(OE1)
VCC: C.1 C.2 IC1.19(!OE2) IC1.20(VCC) IC2.19(!OE2) IC2.20(VCC) IC3.14(VCC) IC4.14(VCC) IC5.19(!OE2) IC5.20(VCC) IC6.19(!OE2) IC6.20(VCC) IC9.9(CLR) IC10.9(CLR) IC11.9(CLR) IC12.19(!OE2) IC12.20(VCC) IC13.19(!OE2) IC13.20(VCC) IC14.19(!OE2) IC14.20(VCC) IC15.19(!OE2) IC15.20(VCC) IC16.19(!OE2) IC16.20(VCC) IC17.19(!OE2) IC17.20(VCC) IC18.19(!OE2) IC18.20(VCC) IC19.19(!OE2) IC19.20(VCC) IC20.19(!OE2) IC20.20(VCC) IC21.19(!OE2) IC21.20(VCC) IC22.19(!OE2) IC22.20(VCC) IC23.19(!OE2) IC23.20(VCC) IC24.19(!OE2) IC24.20(VCC) IC25.19(!OE2) IC25.20(VCC) IC26.19(!OE2) IC26.20(VCC) V8.7(C0) ; supply symbol labelled +UB
Unconnected: C.12 C.13 C.14 C.15 C.16 C.17 C.18 IC9.8(QA*) IC9.17(QH*) IC10.8(QA*) IC10.17(QH*) IC11.8(QA*) IC11.17(QH*) IC26.6(A5) IC26.7(A6) IC26.8(A7) IC26.9(A8) V29.8(/3:Y) V29.9(/3:A) V29.10(/3:B) V29.11(/4:Y) V29.12(/4:A) V29.13(/4:B)

## Buses
BUSA:BUSA_BIT[0..15]
BUSB:BUSB_BIT[0..15]
BUSR:BUSR_BIT[0..15],BUSR_FLAG_CARRY,BUSR_FLAG_NONZERO,BUSR_FLAG_N_OVERFLOW,BUSR_FLAG_SIGN
CONTROL:CLOCK,INPUT_EN,MODE_ADD,MODE_AND,MODE_BIT[0..2],MODE_LSFT,MODE_OR,MODE_RSFT,MODE_SUB,MODE_TEST,MODE_XOR,OUTPUT_DATA_EN,OUTPUT_FLAGS_EN

## Notes on the sheet
- ADD | SUB | OR | AND | XOR
- FLAG_CARRY | FLAG_N_OVERFLOW
- TEST | LSFT | RSFT
- REGR | FLAG_N_ZERO | FLAG_SIGN

## Power pins joined to a net without a drawn wire
GND: IC9.10(GND) IC10.10(GND) IC11.10(GND) V1.8(-UB) V2.8(-UB) V3.8(-UB) V4.8(-UB) V5.7(/-UB:-UB) V6.7(/-UB:-UB) V7.7(/-UB:-UB) V8.8(-UB) V9.8(-UB) V10.8(-UB) V11.8(-UB) V12.7(/-UB:-UB) V13.7(/-UB:-UB) V14.7(/-UB:-UB) V15.7(/-UB:-UB) V16.7(/-UB:-UB) V17.7(/-UB:-UB) V18.7(/-UB:-UB) V19.7(/-UB:-UB) V20.7(/-UB:-UB) V21.7(/-UB:-UB) V22.7(/-UB:-UB) V23.7(/-UB:-UB) V24.7(/-UB:-UB) V25.7(/-UB:-UB) V26.7(/-UB:-UB) V27.7(/-UB:-UB) V28.8(-UB) V29.7(/-UB:-UB)
VCC: IC9.20(VCC) IC10.20(VCC) IC11.20(VCC) V1.16(+UB) V2.16(+UB) V3.16(+UB) V4.16(+UB) V5.14(/+UB:+UB) V6.14(/+UB:+UB) V7.14(/+UB:+UB) V8.16(+UB) V9.16(+UB) V10.16(+UB) V11.16(+UB) V12.14(/+UB:+UB) V13.14(/+UB:+UB) V14.14(/+UB:+UB) V15.14(/+UB:+UB) V16.14(/+UB:+UB) V17.14(/+UB:+UB) V18.14(/+UB:+UB) V19.14(/+UB:+UB) V20.14(/+UB:+UB) V21.14(/+UB:+UB) V22.14(/+UB:+UB) V23.14(/+UB:+UB) V24.14(/+UB:+UB) V25.14(/+UB:+UB) V26.14(/+UB:+UB) V27.14(/+UB:+UB) V28.16(+UB) V29.14(/+UB:+UB)

## Library data of the parts
C = con-3m:2550-: 3M (TM) Pak 100 4-Wall Header Source: 3M; OC_FARNELL: 1788696; OC_NEWARK: unknown
IC1 IC2 IC5 IC6 IC12-IC26 = SamacSys_Parts:SN74CBT3345DW: Texas Instruments SN74CBT3345DW, Bus Switch, 8 x 1:1, 4.5 5.5 V, 20-Pin SOIC Source: Datasheet <https://www.ti.com/lit/ds/symlink/sn74cbt3345.pdf>; DESCRIPTION: Texas Instruments SN74CBT3345DW, Bus Switch, 8 x 1:1, 4.5 5.5 V, 20-Pin SOIC; HEIGHT: 2.65mm; MANUFACTURER_NAME: Texas Instruments; MANUFACTURER_PART_NUMBER: SN74CBT3345DW
IC3 IC4 = SamacSys_Parts:SN74CBT3126D: Quadruple FET Bus Switch Source: Datasheet <http://www.ti.com/lit/gpn/SN74CBT3126>; DESCRIPTION: Quadruple FET Bus Switch; HEIGHT: 1.75mm; MANUFACTURER_NAME: Texas Instruments; MANUFACTURER_PART_NUMBER: SN74CBT3126D
IC9-IC11 = 74xx-eu:74*299: 8-bit universal SHIFT/STORAGE REGISTER
R1 = rcl:R-EU_: RESISTOR, European symbol; SPICEPREFIX: R
V1-V4 V8-V11 = 74ttl-din:74*283: 4-bit binary FULL ADDER, fast carry
V5-V7 = 74ttl-din:74*04: Hex INVERTER
V12-V15 V24-V27 = 74ttl-din:74*32: Quad 2-input OR gate
V16-V19 = 74ttl-din:74*08: Quad 2-input AND gate
V20-V23 V29 = 74ttl-din:74*86: Quad 2-input EXCLUSIV-OR gate
V28 = 74ttl-din:74*238: 1 of 8 noninverting DECODER/DEMULTIPLEXER